# EAGLE schematic vehicle_control_module (EAGLE 9.5.2), part 2 of 2
## Sheet 16 of 16
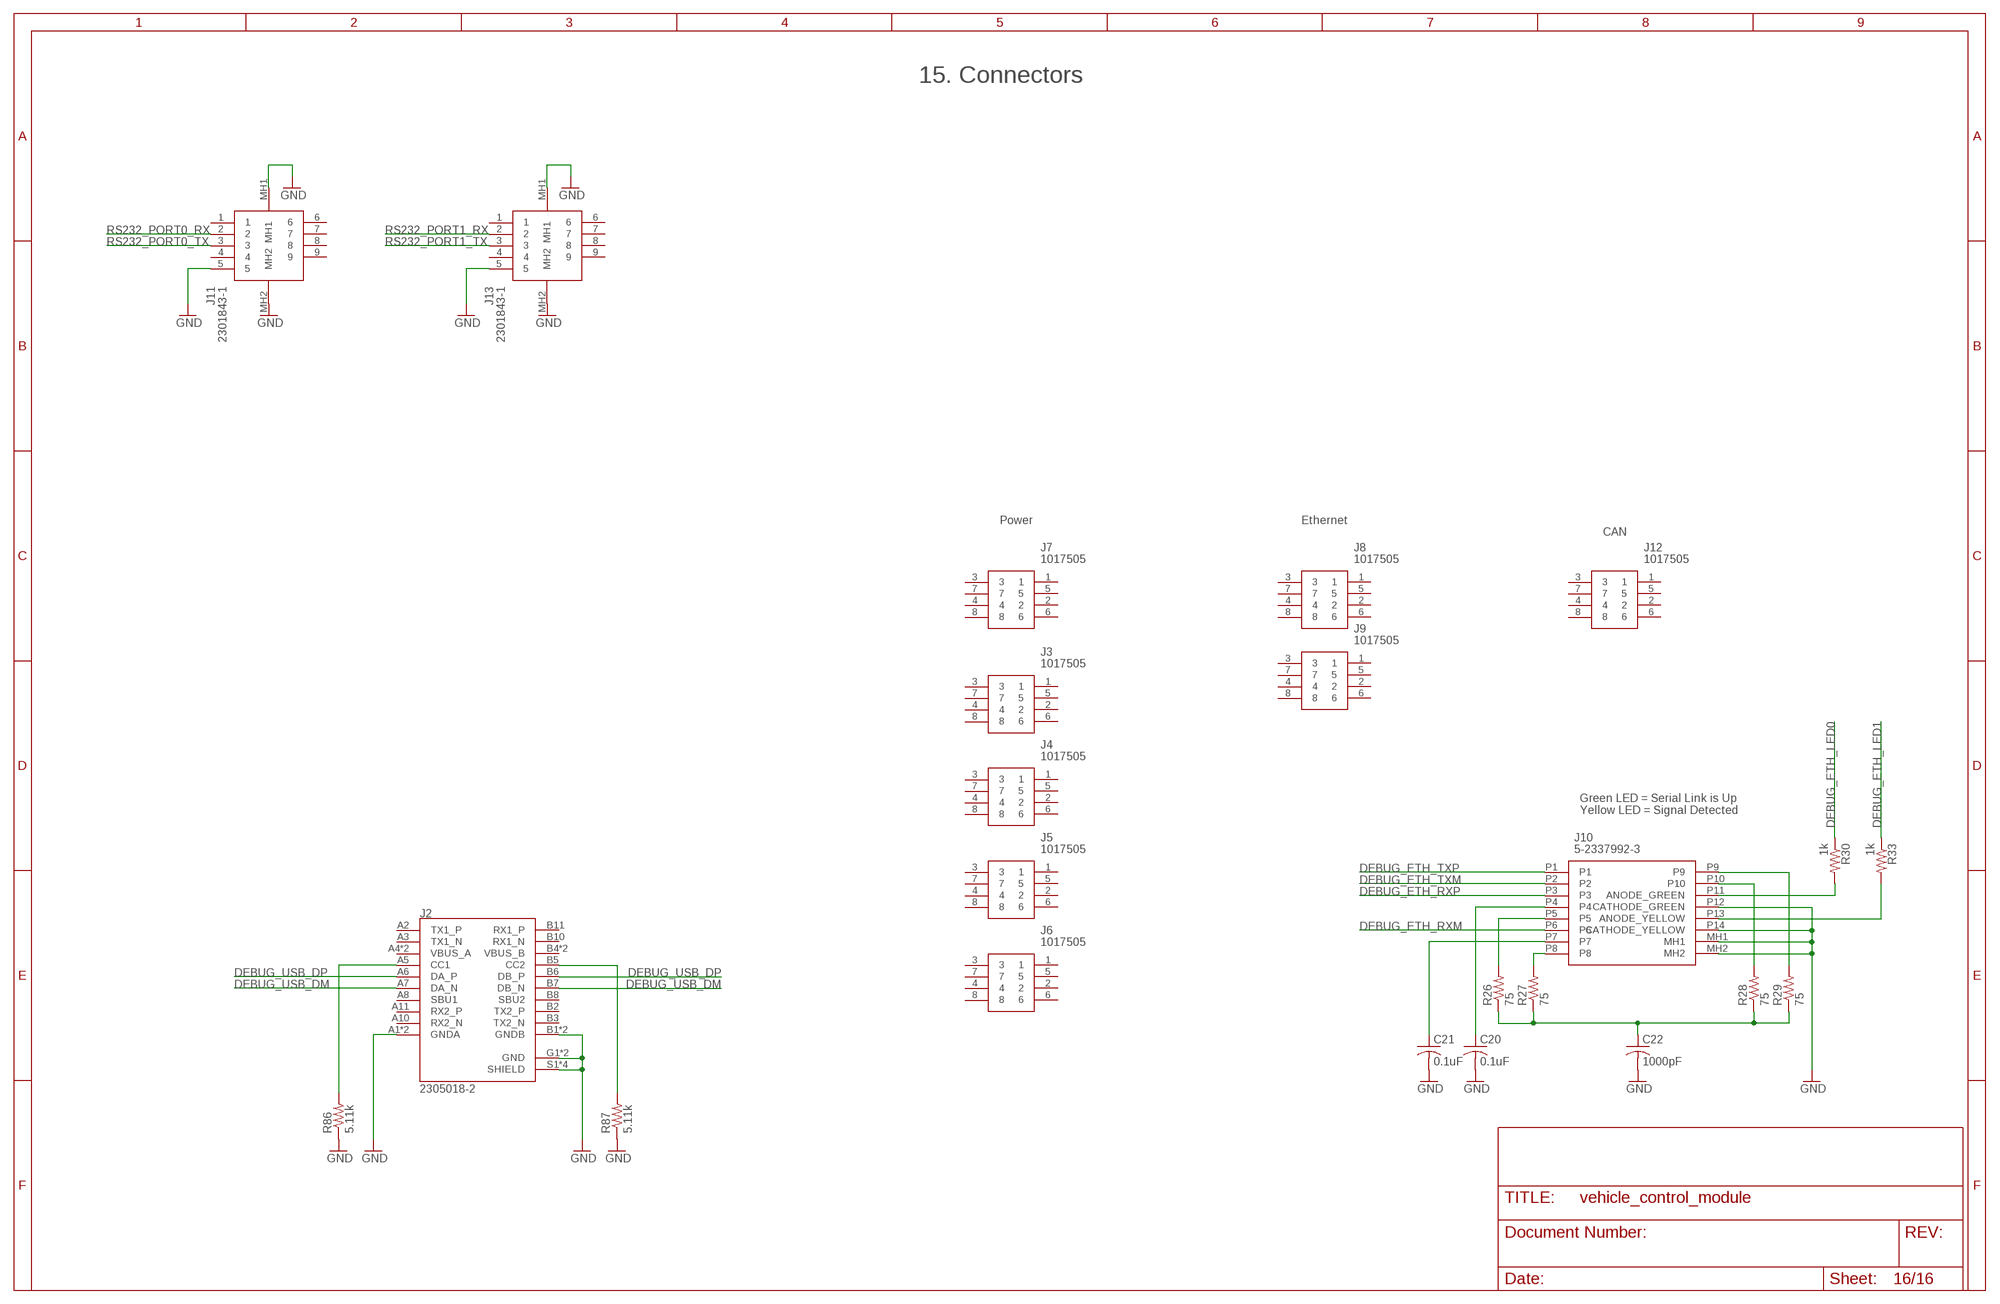
[diagram p15: schematic, sheet 16]

### Parts
C20  0.1uF  C-USC0603  [C0603]
C21  0.1uF  C-USC0603  [C0603]
C22  1000pF  C-USC0603  [C0603]
J2  2305018-2  [TE_2305018-2]
J3  1017505  [1017505]
J4  1017505  [1017505]
J5  1017505  [1017505]
J6  1017505  [1017505]
J7  1017505  [1017505]
J8  1017505  [1017505]
J9  1017505  [1017505]
J10  5-2337992-3  [523379923]
J11  2301843-1  [23018431]
J12  1017505  [1017505]
J13  2301843-1  [23018431]
R26  75  R-US_R0603  [R0603]
R27  75  R-US_R0603  [R0603]
R28  75  R-US_R0603  [R0603]
R29  75  R-US_R0603  [R0603]
R30  1k  R-US_R0603  [R0603]
R33  1k  R-US_R0603  [R0603]
R86  5.11k  R-US_R0603  [R0603]
R87  5.11k  R-US_R0603  [R0603]

### Nets
DEBUG_ETH_LED0: R30.1 ; also sheet 10
DEBUG_ETH_LED1: R33.1 ; also sheet 10
DEBUG_ETH_RXM: J10.P6 ; also sheet 10
DEBUG_ETH_RXP: J10.P3 ; also sheet 10
DEBUG_ETH_TXM: J10.P2 ; also sheet 10
DEBUG_ETH_TXP: J10.P1 ; also sheet 10
DEBUG_USB_DM: J2.A7(DA_N) J2.B7(DB_N) ; also sheet 4
DEBUG_USB_DP: J2.A6(DA_P) J2.B6(DB_P) ; also sheet 4
GND: C20.2 C21.2 C22.2 J2.A1(GNDA) J2.A12(GNDA) J2.B1(GNDB) J2.B12(GNDB) J2.G1(GND) J2.G2(GND) J2.S1(SHIELD) J2.S2(SHIELD) J2.S3(SHIELD) J2.S4(SHIELD) J10.MH1 J10.MH2 J10.P12(CATHODE_GREEN) J10.P14(CATHODE_YELLOW) J11.5 J11.MH1 J11.MH2 J13.5 J13.MH1 J13.MH2 R86.1 R87.1 ; also sheet 2,3,4,5,6,7,8,9,10,11,12,13,14,15
N$24: J10.P13(ANODE_YELLOW) R33.2
N$25: C20.1 J10.P4
N$26: J10.P5 R26.2
N$27: C21.1 J10.P7
N$28: J10.P8 R27.2
N$38: J10.P11(ANODE_GREEN) R30.2
N$39: J10.P10 R28.2
N$40: J10.P9 R29.2
N$41: C22.1 R26.1 R27.1 R28.1 R29.1
N$67: J2.A5(CC1) R86.2
N$68: J2.B5(CC2) R87.2
RS232_PORT0_RX: J11.2 ; also sheet 4
RS232_PORT0_TX: J11.3 ; also sheet 4
RS232_PORT1_RX: J13.2 ; also sheet 4
RS232_PORT1_TX: J13.3 ; also sheet 4
Unconnected: J2.A2(TX1_P) J2.A3(TX1_N) J2.A4(VBUS_A) J2.A8(SBU1) J2.A9(VBUS_A) J2.A10(RX2_N) J2.A11(RX2_P) J2.B2(TX2_P) J2.B3(TX2_N) J2.B4(VBUS_B) J2.B8(SBU2) J2.B9(VBUS_B) J2.B10(RX1_N) J2.B11(RX1_P) J3.1 J3.2 J3.3 J3.4 J3.5 J3.6 J3.7 J3.8 J4.1 J4.2 J4.3 J4.4 J4.5 J4.6 J4.7 J4.8 J5.1 J5.2 J5.3 J5.4 J5.5 J5.6 J5.7 J5.8 J6.1 J6.2 J6.3 J6.4 J6.5 J6.6 J6.7 J6.8 J7.1 J7.2 J7.3 J7.4 J7.5 J7.6 J7.7 J7.8 J8.1 J8.2 J8.3 J8.4 J8.5 J8.6 J8.7 J8.8 J9.1 J9.2 J9.3 J9.4 J9.5 J9.6 J9.7 J9.8 J11.1 J11.4 J11.6 J11.7 J11.8 J11.9 J12.1 J12.2 J12.3 J12.4 J12.5 J12.6 J12.7 J12.8 J13.1 J13.4 J13.6 J13.7 J13.8 J13.9

### Notes on the sheet
- 15. Connectors
- Power | Ethernet
- CAN
- Green LED = Serial Link is Up
  Yellow LED = Signal Detected

## Library data of the parts
C1-C29 C32-C85 C87-C96 C98-C172 = rcl:C-US: CAPACITOR, American symbol; SPICEPREFIX: C
C86 C97 = samacsys:UCZ1K151MNQ1MS: Aluminum Electrolytic Capacitors - SMD 80V 150UF 20% Source: Datasheet <http://www.nichicon.co.jp/english/products/pdfs/e-ucz.pdf>; DESCRIPTION: Aluminum Electrolytic Capacitors - SMD 80V 150UF 20%; HEIGHT: 14.5mm; MANUFACTURER_NAME: Nichicon; MANUFACTURER_PART_NUMBER: UCZ1K151MNQ1MS; MOUSER_PART_NUMBER: 647-UCZ1K151MNQ1MS; MOUSER_PRICE-STOCK: https://www.mouser.com/Search/Refine.aspx?Keyword=647-UCZ1K151MNQ1MS
D1-D3 = samacsys:PESD2ETH-AXR: ESD Suppressors / TVS Diodes PESD2ETH-AX/SOT4/REEL 7" Q3/T4 Source: Datasheet <https://assets.nexperia.com/documents/data-sheet/PESD2ETH-AX.pdf>; DESCRIPTION: ESD Suppressors / TVS Diodes PESD2ETH-AX/SOT4/REEL 7" Q3/T4; HEIGHT: 1mm; MANUFACTURER_NAME: Nexperia; MANUFACTURER_PART_NUMBER: PESD2ETH-AXR; MOUSER_PART_NUMBER: 771-PESD2ETH-AXR; MOUSER_PRICE-STOCK: https://www.mouser.com/Search/Refine.aspx?Keyword=771-PESD2ETH-AXR
D4-D6 D9 = samacsys:PMEG3030EP,115: Nexperia PMEG3030EP,115 SMT Schottky Diode, 30V 3A, 2-Pin SOD128 Source: Datasheet <https://assets.nexperia.com/documents/data-sheet/PMEG3030EP.pdf>; DESCRIPTION: Nexperia PMEG3030EP,115 SMT Schottky Diode, 30V 3A, 2-Pin SOD128; HEIGHT: 1.1mm; MANUFACTURER_NAME: Nexperia; MANUFACTURER_PART_NUMBER: PMEG3030EP,115; MOUSER_PART_NUMBER: 771-PMEG3030EP115; MOUSER_PRICE-STOCK: https://www.mouser.com/Search/Refine.aspx?Keyword=771-PMEG3030EP115; RS_PART_NUMBER: 7805391P; RS_PRICE-STOCK: http://uk.rs-online.com/web/p/products/7805391P
D7 D8 = samacsys:SMAJ24CA-Q: Bourns SMAJ24CA-Q, Bi-Directional TVS Diode, 400W, 2-Pin DO-214AC Source: Datasheet <https://www.bourns.com/docs/Product-Datasheets/SMAJ-Q.pdf>; DESCRIPTION: Bourns SMAJ24CA-Q, Bi-Directional TVS Diode, 400W, 2-Pin DO-214AC; HEIGHT: 2.29mm; MANUFACTURER_NAME: Bourns; MANUFACTURER_PART_NUMBER: SMAJ24CA-Q; MOUSER_PART_NUMBER: 652-SMAJ24CA-Q; MOUSER_PRICE-STOCK: https://www.mouser.com/Search/Refine.aspx?Keyword=652-SMAJ24CA-Q; RS_PART_NUMBER: 1723235P; RS_PRICE-STOCK: http://uk.rs-online.com/web/p/products/1723235P
D10-D35 = samacsys:BAT54SWFILMY: STMICROELECTRONICS - BAT54SWFILMY - SCHOTTKY DIODE, DUAL, AUTO, 0.3A, 40V Source: Datasheet <https://www.st.com/resource/en/datasheet/cd00001322.pdf>; DESCRIPTION: STMICROELECTRONICS - BAT54SWFILMY - SCHOTTKY DIODE, DUAL, AUTO, 0.3A, 40V; HEIGHT: 1.1mm; MANUFACTURER_NAME: STMicroelectronics; MANUFACTURER_PART_NUMBER: BAT54SWFILMY; MOUSER_PART_NUMBER: 511-BAT54SWFILMY; MOUSER_PRICE-STOCK: https://www.mouser.com/Search/Refine.aspx?Keyword=511-BAT54SWFILMY
FL1 FL5 FL9 = samacsys:ACT45L-201-2P-TL000: Common mode choke SMD 200uH 100mA 50V TDK ACT Series Shielded SMD Common Mode Line Filter 200 uH -30 %, 50 % 100mA Idc Source: Datasheet <http://docs-emea.rs-online.com/webdocs/14e9/0900766b814e92b2.pdf>; DESCRIPTION: Common mode choke SMD 200uH 100mA 50V TDK ACT Series Shielded SMD Common Mode Line Filter 200 uH -30 %, 50 % 100mA Idc; HEIGHT: mm; MANUFACTURER_NAME: TDK; MANUFACTURER_PART_NUMBER: ACT45L-201-2P-TL000; MOUSER_PART_NUMBER: 810-ACT45L2012PTL000; MOUSER_PRICE-STOCK: https://www.mouser.com/Search/Refine.aspx?Keyword=810-ACT45L2012PTL000; RS_PART_NUMBER: 8319282P; RS_PRICE-STOCK: http://uk.rs-online.com/web/p/products/8319282P
FL2-FL4 FL6-FL8 FL10-FL12 = samacsys:BLM18PG330SN1D: BLM18_N1D Series EMI Suppression Filter 33+/-25% at 100MHz 3A @85 Source: Datasheet <https://www.murata.com/en-us/products/productdetail?partno=BLM18PG330SN1#>; DESCRIPTION: BLM18_N1D Series EMI Suppression Filter 33+/-25% at 100MHz 3A @85; HEIGHT: 0.95mm; MANUFACTURER_NAME: Murata Electronics; MANUFACTURER_PART_NUMBER: BLM18PG330SN1D; MOUSER_PART_NUMBER: 81-BLM18PG330SN1D; MOUSER_PRICE-STOCK: https://www.mouser.com/Search/Refine.aspx?Keyword=81-BLM18PG330SN1D; RS_PART_NUMBER: 7241416P; RS_PRICE-STOCK: http://uk.rs-online.com/web/p/products/7241416P
IC1 = samacsys:SJA1105TELY: Ethernet ICs SJA1105TEL/LFBGA159///REEL 13 Q1/T1 *STANDARD MAR Source: Datasheet <https://www.nxp.com/docs/en/data-sheet/SJA1105.pdf>; DESCRIPTION: Ethernet ICs SJA1105TEL/LFBGA159///REEL 13 Q1/T1 *STANDARD MAR; HEIGHT: 1.5mm; MANUFACTURER_NAME: Nexperia; MANUFACTURER_PART_NUMBER: SJA1105TELY; MOUSER_PART_NUMBER: 771-SJA1105TELY; MOUSER_PRICE-STOCK: https://www.mouser.com/Search/Refine.aspx?Keyword=771-SJA1105TELY
IC2 = samacsys:ATSAMV71Q21B-AABT: ARM Microcontrollers - MCU 2MB FLASH 384KB SRAM LQFP144 T/R Source: Datasheet <https://www.mouser.com/datasheet/2/268/SAM-E70S70V70V71-Family_DataSheet-DS60001527B-1374834.pdf>; DESCRIPTION: ARM Microcontrollers - MCU 2MB FLASH 384KB SRAM LQFP144 T/R; HEIGHT: 1.6mm; MANUFACTURER_NAME: Microchip; MANUFACTURER_PART_NUMBER: ATSAMV71Q21B-AABT; MOUSER_PART_NUMBER: 579-ATSAMV71Q21BAABT; MOUSER_PRICE-STOCK: https://www.mouser.com/Search/Refine.aspx?Keyword=579-ATSAMV71Q21BAABT
IC3 IC10 IC12 = samacsys:TJA1100HNZ: NXP - TJA1100HNZ - ETHERNET PHY, AEC-Q100, 100MBPS, HVQFN36 Source: Datasheet <https://www.nxp.com/docs/en/data-sheet/TJA1100.pdf>; DESCRIPTION: NXP - TJA1100HNZ - ETHERNET PHY, AEC-Q100, 100MBPS, HVQFN36; HEIGHT: 1mm; MANUFACTURER_NAME: Nexperia; MANUFACTURER_PART_NUMBER: TJA1100HNZ; MOUSER_PART_NUMBER: 771-TJA1100HNZ; MOUSER_PRICE-STOCK: https://www.mouser.com/Search/Refine.aspx?Keyword=771-TJA1100HNZ
IC4 = samacsys:FT2232HL: Dual High Speed USB UART/FIFO IC, LQFP64 FTDI Chip FT2232HL Dual UART Interface RS232, RS422, RS485 480Mbit/s, 64-Pin, LQFP Source: Datasheet <http://docs-emea.rs-online.com/webdocs/1384/0900766b81384546.pdf>; DESCRIPTION: Dual High Speed USB UART/FIFO IC, LQFP64 FTDI Chip FT2232HL Dual UART Interface RS232, RS422, RS485 480Mbit/s, 64-Pin, LQFP; HEIGHT: 1.6mm; MANUFACTURER_NAME: FTDI Chip; MANUFACTURER_PART_NUMBER: FT2232HL; RS_PART_NUMBER: 6877720P; RS_PRICE-STOCK: http://uk.rs-online.com/web/p/products/6877720P
IC5 = samacsys:TRS3232EQPWRQ1: Automotive Catalog 3-V to 5.5-V Multichannel RS-232 Line Driver/Receiver With +/-15-kV ESD Protectio Source: Datasheet <http://www.ti.com/lit/gpn/trs3232e-q1>; DESCRIPTION: Automotive Catalog 3-V to 5.5-V Multichannel RS-232 Line Driver/Receiver With +/-15-kV ESD Protectio; HEIGHT: 1.2mm; MANUFACTURER_NAME: Texas Instruments; MANUFACTURER_PART_NUMBER: TRS3232EQPWRQ1; MOUSER_PART_NUMBER: 595-TRS3232EQPWRQ1; MOUSER_PRICE-STOCK: https://www.mouser.com/Search/Refine.aspx?Keyword=595-TRS3232EQPWRQ1
IC6 = samacsys:SST26VF032BT-104I_SM: Microchip Technology SST26VF032BT-104I/SM 32Mbit Flash Memory Chip, 8-Pin SOIJ Source: Datasheet <http://www.microchip.com/mymicrochip/filehandler.aspx?ddocname=en566514>; ALLIED_NUMBER: 70571081; ALLIED_PRICE-STOCK: https://www.alliedelec.com/microchiptechnologyinc-sst26vf032bt-104i-sm/70571081/; DESCRIPTION: Microchip Technology SST26VF032BT-104I/SM 32Mbit Flash Memory Chip, 8-Pin SOIJ; HEIGHT: 2.03mm; MANUFACTURER_NAME: Microchip; MANUFACTURER_PART_NUMBER: SST26VF032BT-104I/SM; MOUSER_PART_NUMBER: 579-T26VF032BT104ISM; MOUSER_PRICE-STOCK: https://www.mouser.com/Search/Refine.aspx?Keyword=579-T26VF032BT104ISM; RS_PART_NUMBER: 1779838P; RS_PRICE-STOCK: http://uk.rs-online.com/web/p/products/1779838P
IC7 = samacsys:DS3231SN#: Real Time Clock Serial Maxim DS3231SN# Real Time Clock, Battery Backup, Calendar, Clock, I2C, 5.5 V, 16-Pin SOIC Source: Datasheet <https://datasheets.maximintegrated.com/en/ds/DS3231.pdf>; DESCRIPTION: Real Time Clock Serial Maxim DS3231SN# Real Time Clock, Battery Backup, Calendar, Clock, I2C, 5.5 V, 16-Pin SOIC; HEIGHT: 2.65mm; MANUFACTURER_NAME: Maxim Integrated; MANUFACTURER_PART_NUMBER: DS3231SN#; MOUSER_PART_NUMBER: 700-DS3231SN#; MOUSER_PRICE-STOCK: https://www.mouser.com/Search/Refine.aspx?Keyword=700-DS3231SN%23; RS_PART_NUMBER: 1897251; RS_PRICE-STOCK: http://uk.rs-online.com/web/p/products/1897251
IC8 = samacsys:74HC7541D-Q100J: 74HC(T)7541-Q100 - Octal Schmitt trigger buffer/line driver; 3-state@en-us Source: Datasheet <https://assets.nexperia.com/documents/data-sheet/74HC_HCT7541_Q100.pdf>; DESCRIPTION: 74HC(T)7541-Q100 - Octal Schmitt trigger buffer/line driver; 3-state@en-us; HEIGHT: 2.65mm; MANUFACTURER_NAME: Nexperia; MANUFACTURER_PART_NUMBER: 74HC7541D-Q100J; MOUSER_PART_NUMBER: 771-74HC7541D-Q100J; MOUSER_PRICE-STOCK: https://www.mouser.com/Search/Refine.aspx?Keyword=771-74HC7541D-Q100J
IC9 = samacsys:TPS62242DRVR: 1.2V / 300mA Step-Down Converter in 2x2mm SON/TSOT23 Package Source: Datasheet <http://www.ti.com/lit/gpn/TPS62242>; DESCRIPTION: 1.2V / 300mA Step-Down Converter in 2x2mm SON/TSOT23 Package; HEIGHT: 0.8mm; MANUFACTURER_NAME: Texas Instruments; MANUFACTURER_PART_NUMBER: TPS62242DRVR; MOUSER_PART_NUMBER: 595-TPS62242DRVR; MOUSER_PRICE-STOCK: https://www.mouser.com/Search/Refine.aspx?Keyword=595-TPS62242DRVR
IC11 = samacsys:KSZ8061MNXI-TR: Ethernet ICs 10/100 Base-TX/FX Quiet-Wire x-ceiver Source: Datasheet <https://componentsearchengine.com/Datasheets/1/KSZ8061MNXI-TR.pdf>; DESCRIPTION: Ethernet ICs 10/100 Base-TX/FX Quiet-Wire x-ceiver; HEIGHT: 0.85mm; MANUFACTURER_NAME: Microchip; MANUFACTURER_PART_NUMBER: KSZ8061MNXI-TR; MOUSER_PART_NUMBER: 579-KSZ8061MNXI-TR; MOUSER_PRICE-STOCK: https://www.mouser.com/Search/Refine.aspx?Keyword=579-KSZ8061MNXI-TR
IC13 IC18 = samacsys:TLE9250XSJXUMA1: CAN Interface IC TRANSCEIVER Source: Datasheet <https://www.infineon.com/dgdl/Infineon-TLE9250X-DS-v01_00-EN.pdf?fileId=5546d4625debb399015e14b8cc665980>; DESCRIPTION: CAN Interface IC TRANSCEIVER; HEIGHT: 1.73mm; MANUFACTURER_NAME: Infineon; MANUFACTURER_PART_NUMBER: TLE9250XSJXUMA1; MOUSER_PART_NUMBER: 726-TLE9250XSJXUMA1; MOUSER_PRICE-STOCK: https://www.mouser.com/Search/Refine.aspx?Keyword=726-TLE9250XSJXUMA1
IC17 = samacsys:LP5907QMFX-3.3Q1: Automotive 250-mA ultra-low-noise low-IQ low-dropout (LDO) linear regulator Source: Datasheet <http://www.ti.com/lit/gpn/lp5907-q1>; DESCRIPTION: Automotive 250-mA ultra-low-noise low-IQ low-dropout (LDO) linear regulator; HEIGHT: 1.45mm; MANUFACTURER_NAME: Texas Instruments; MANUFACTURER_PART_NUMBER: LP5907QMFX-3.3Q1; MOUSER_PART_NUMBER: 595-LP5907QMFX-3.3Q1; MOUSER_PRICE-STOCK: https://www.mouser.com/Search/Refine.aspx?Keyword=595-LP5907QMFX-3.3Q1
J2 = 2305018-2:2305018-2: TYPE C Right Angle Sealable SMT IPX8 3.1 GEN 2 Wire to Board USB; MANUFACTURER: TE Connectivity; PARTREV: 6.0; STANDRAD: Manufacturer Recommendation
J3-J9 J12 = samacsys:1017505: Phoenix Contact TDPT Series 5.08mm Pitch, PCB Terminal Block, PCB Mount, 4 Way Source: Datasheet <https://www.phoenixcontact.com/online/portal/gb/?uri=pxc-oc-itemdetail:pid=1017505&library=gben&pcck=P-11-01-05&tab=1&selectedCategory=ALL>; ALLIED_NUMBER: 71241694; ALLIED_PRICE-STOCK: https://www.alliedelec.com/phoenixcontact-1017505/71241694/; DESCRIPTION: Phoenix Contact TDPT Series 5.08mm Pitch, PCB Terminal Block, PCB Mount, 4 Way; HEIGHT: 19.2mm; MANUFACTURER_NAME: Phoenix Contact; MANUFACTURER_PART_NUMBER: 1017505; MOUSER_PART_NUMBER: 651-1017505; MOUSER_PRICE-STOCK: https://www.mouser.com/Search/Refine.aspx?Keyword=651-1017505; RS_PART_NUMBER: 1753922; RS_PRICE-STOCK: http://uk.rs-online.com/web/p/products/1753922
J10 = samacsys:5-2337992-3: RJ45 JACK MAG. POE 10/100 LED 1X1 INV.-5-2337992-3 Industrial RJ45 IP20 , Industrial RJ45 Mag Jack Source: Datasheet <https://www.te.com/commerce/DocumentDelivery/DDEController?Action=showdoc&DocId=Customer Drawing5-2337992-3ApdfEnglishENG_CD_5-2337992-3_A.pdf5-2337992-3>; ALLIED_NUMBER: 71642175; ALLIED_PRICE-STOCK: https://www.alliedelec.com/teconnectivity-5-2337992-3/71642175/; DESCRIPTION: RJ45 JACK MAG. POE 10/100 LED 1X1 INV.-5-2337992-3 Industrial RJ45 IP20 , Industrial RJ45 Mag Jack; HEIGHT: 13.8mm; MANUFACTURER_NAME: TE Connectivity; MANUFACTURER_PART_NUMBER: 5-2337992-3; MOUSER_PART_NUMBER: 571-5-2337992-3; MOUSER_PRICE-STOCK: https://www.mouser.com/Search/Refine.aspx?Keyword=571-5-2337992-3
J11 J13 = samacsys:2301843-1: TE CONNECTIVITY - 2301843-1 - D-SUB CONN, PLUG, 9POS, THROUGH HOLE Source: Datasheet <https://componentsearchengine.com/Datasheets/2/2301843-1.pdf>; DESCRIPTION: TE CONNECTIVITY - 2301843-1 - D-SUB CONN, PLUG, 9POS, THROUGH HOLE; HEIGHT: 13.955mm; MANUFACTURER_NAME: TE Connectivity; MANUFACTURER_PART_NUMBER: 2301843-1; MOUSER_PART_NUMBER: 571-2301843-1; MOUSER_PRICE-STOCK: https://www.mouser.com/Search/Refine.aspx?Keyword=571-2301843-1
J15 = samacsys:693022010811: WURTH ELEKTRONIK - 693022010811 - CONN, MICRO SIM, HINGE, 8POS Source: Datasheet <http://katalog.we-online.de/em/datasheet/693022010811.pdf>; DESCRIPTION: WURTH ELEKTRONIK - 693022010811 - CONN, MICRO SIM, HINGE, 8POS; HEIGHT: mm; MANUFACTURER_NAME: Wurth Elektronik; MANUFACTURER_PART_NUMBER: 693022010811; MOUSER_PART_NUMBER: 710-693022010811; MOUSER_PRICE-STOCK: https://www.mouser.com/Search/Refine.aspx?Keyword=710-693022010811; RS_PART_NUMBER: 1621816; RS_PRICE-STOCK: http://uk.rs-online.com/web/p/products/1621816
J27 = samacsys:2041119-2: PCI Express / PCI Connectors mSATA/mini PCI-E 4H Type I 10u Source: Datasheet <https://www.te.com/commerce/DocumentDelivery/DDEController?Action=showdoc&DocId=Customer Drawing2041119DpdfEnglishENG_CD_2041119_D.pdf2041119-2>; DESCRIPTION: PCI Express / PCI Connectors mSATA/mini PCI-E 4H Type I 10u; HEIGHT: 4mm; MANUFACTURER_NAME: TE Connectivity; MANUFACTURER_PART_NUMBER: 2041119-2; MOUSER_PART_NUMBER: 571-2041119-2; MOUSER_PRICE-STOCK: https://www.mouser.com/Search/Refine.aspx?Keyword=571-2041119-2
L1-L6 = samacsys:0603CS-R12XGLU: COILCRAFT - 0603CS-R12XGLU - High Frequency Inductor, 120 nH, 0603CS Series, 300 mA, 0603 [1608 Metric], Wirewound, 0.65 ohm Source: Datasheet <https://www.coilcraft.com/pdfs/0603cs.pdf>; DESCRIPTION: COILCRAFT - 0603CS-R12XGLU - High Frequency Inductor, 120 nH, 0603CS Series, 300 mA, 0603 [1608 Metric], Wirewound, 0.65 ohm; HEIGHT: 1mm; MANUFACTURER_NAME: COILCRAFT; MANUFACTURER_PART_NUMBER: 0603CS-R12XGLU; MOUSER_PART_NUMBER: 994-0603CS-R12XGLU; MOUSER_PRICE-STOCK: https://www.mouser.com/Search/Refine.aspx?Keyword=994-0603CS-R12XGLU
L7 = samacsys:XAL4020-102MEC: Fixed Inductors 1uH 20% 9.6A 14.60mOhms AEC-Q200 Source: Datasheet <https://www.coilcraft.com/pdfs/xal4000.pdf>; DESCRIPTION: Fixed Inductors 1uH 20% 9.6A 14.60mOhms AEC-Q200; HEIGHT: mm; MANUFACTURER_NAME: COILCRAFT; MANUFACTURER_PART_NUMBER: XAL4020-102MEC; MOUSER_PART_NUMBER: 994-XAL4020-102MEC; MOUSER_PRICE-STOCK: https://www.mouser.com/Search/Refine.aspx?Keyword=994-XAL4020-102MEC
L8 = samacsys:XAL4040-103MEC: Fixed Inductors XAL4040 High Current 10 uH 20 % 3.1 A Source: Datasheet <http://www.mouser.com/ds/2/597/xal4000-270751.pdf>; DESCRIPTION: Fixed Inductors XAL4040 High Current 10 uH 20 % 3.1 A; HEIGHT: mm; MANUFACTURER_NAME: COILCRAFT; MANUFACTURER_PART_NUMBER: XAL4040-103MEC; MOUSER_PART_NUMBER: 994-XAL4040-103MEC; MOUSER_PRICE-STOCK: https://www.mouser.com/Search/Refine.aspx?Keyword=994-XAL4040-103MEC
L9 = samacsys:DO3316P-103MLB: Fixed Inductors DO3316P SMT Pwr Ind 10 uH 20 % 3.9 A Source: Datasheet <https://componentsearchengine.com/Datasheets/1/DO3316P-103MLB.pdf>; DESCRIPTION: Fixed Inductors DO3316P SMT Pwr Ind 10 uH 20 % 3.9 A; HEIGHT: 5.21mm; MANUFACTURER_NAME: COILCRAFT; MANUFACTURER_PART_NUMBER: DO3316P-103MLB; MOUSER_PART_NUMBER: 994-DO3316P-103MLB; MOUSER_PRICE-STOCK: https://www.mouser.com/Search/Refine.aspx?Keyword=994-DO3316P-103MLB
L10 = samacsys:LPS3015-222MRB: COILCRAFT - LPS3015-222MRB - INDUCTOR, SHLD, 2.2UH, 20%, 1.1A, SMD Source: Datasheet <https://www.coilcraft.com/misc/lps3015d.html>; DESCRIPTION: COILCRAFT - LPS3015-222MRB - INDUCTOR, SHLD, 2.2UH, 20%, 1.1A, SMD; HEIGHT: mm; MANUFACTURER_NAME: COILCRAFT; MANUFACTURER_PART_NUMBER: LPS3015-222MRB; MOUSER_PART_NUMBER: 994-LPS3015-222MRB; MOUSER_PRICE-STOCK: https://www.mouser.com/Search/Refine.aspx?Keyword=994-LPS3015-222MRB
LED1-LED16 = led:LED: LED OSRAM: - CHIPLED LG R971, LG N971, LY N971, LG Q971, LY Q971, LO R971, LY R971 LH N974, LH R974 LS Q976, LO Q976, LY Q976 LO Q996 - Hyper CHIPLED LW Q18S LB Q993, LB Q99A, LB R99A - SideLED LS A670, LO A670, LY A670, LG A670, LP A670 LB A673, LV A673, LT A673, LW A673 LH A674 LY A675 LS A676, LA A676, LO A676, LY A676, LW A676 LS A679, LY A679, LG A679 - Hyper Micro SIDELED® LS Y876, LA Y876, LO Y876, LY Y876 LT Y87S - SmartLED LW L88C, LW L88S LB L89C, LB L89S, LG L890 LS L89K, LO L89K, LY L89K LS L896, LA L896, LO L896, LY L896 - TOPLED LS T670, LO T670, LY T670, LG T670, LP T670 LSG T670, LSP T670, LSY T670, LOP T670, LYG T670 LG T671, LOG T671, LSG T671 LB T673, LV T673, LT T673, LW T673 LH T674 LS T676, LA T676, LO T676, LY T676, LB T676, LH T676, LSB T676, LW T676 LB T67C, LV T67C, LT T67C, LS T67K, LO T67K, LY T67K, LW E67C LS E67B, LA E67B, LO E67B, LY E67B, LB E67C, LV E67C, LT E67C LW T67C LS T679, LY T679, LG T679 LS T770, LO T770, LY T770, LG T770, LP T770 LB T773, LV T773, LT T773, LW T773 LH T774 LS E675, LA E675, LY E675, LS T675 LS T776, LA T776, LO T776, LY T776, LB T776 LHGB T686 LT T68C, LB T68C - Hyper Mini TOPLED® LB M676 - Mini TOPLED Santana® LG M470 LS M47K, LO M47K, LY M47K Source: http://www.osram.convergy.de LUXEON: - LUMILED® LXK2-PW12-R00, LXK2-PW12-S00, LXK2-PW14-U00, LXK2-PW14-V00 LXK2-PM12-R00, LXK2-PM12-S00, LXK2-PM14-U00 LXK2-PE12-Q00, LXK2-PE12-R00, LXK2-PE12-S00, LXK2-PE14-T00, LXK2-PE14-U00 LXK2-PB12-K00, LXK2-PB12-L00, LXK2-PB12-M00, LXK2-PB14-N00, LXK2-PB14-P00, LXK2-PB14-Q00 LXK2-PR12-L00, LXK2-PR12-M00, LXK2-PR14-Q00, LXK2-PR14-R00 LXK2-PD12-Q00, LXK2-PD12-R00, LXK2-PD12-S00 LXK2-PH12-R00, LXK2-PH12-S00 LXK2-PL12-P00, LXK2-PL12-Q00, LXK2-PL12-R00 Source: www.luxeon.com KINGBRIGHT: KA-3528ASYC Source: www.kingbright.com
R1-R199 = rcl:R-US_: RESISTOR, American symbol; SPICEPREFIX: R
TC1 = TagConnect:TC2050-IDC: Tag-Connect In Circuit Programming & Debug Cable 10 Pin http://www.tag-connect.com
U1 = samacsys:122-2920-GR: Coin Cell Battery Holders 20MM THRUHOLE WH Source: Datasheet <https://www.mouser.com/datasheet/2/209/EPD-200695-1171359.pdf>; DESCRIPTION: Coin Cell Battery Holders 20MM THRUHOLE WH; HEIGHT: 5.5mm; MANUFACTURER_NAME: Eagle Plastic Devices; MANUFACTURER_PART_NUMBER: 122-2920-GR; MOUSER_PART_NUMBER: 122-2920-GR; MOUSER_PRICE-STOCK: https://www.mouser.com/Search/Refine.aspx?Keyword=122-2920-GR
U2 = LM63625:LM63625DQPWPRQ1; MANUFACTURER: Texas Instruments; PARTNUMBER: LM63625DQPWPTQ1; REFDES: RefDes; TYPE: TYPE; VALUE: Value
U3 = TPS62007:TPS62007-Q1_DGS_10; DATASHEET_URL: http://www.ti.com/lit/gpn/TPS62007-Q1; DESCRIPTION: Automotive Catalog High-Efficiency Step-Down Low Power DC-DC Converter; FAMILY_NAME: STEP-DOWN REGULATOR; GENERIC_PART_NUMBER: TPS62007-Q1; INDUSTRY_STD_PKG_TYPE: MSOP; MANUFACTURER: Texas Instruments; MANUFACTURER_PART_NUMBER: TPS62007-Q1_DGS_10; PACKAGE_DESIGNATOR: DGS; PIN_COUNT: 10; VENDOR: Texas Instruments
U?1-U?18 = BTS50015-1TAD:BTS50015-1TAD: BTS50015-1TAD TO127P1500X450-7_8N-V1 Smart High-Side Power Switch, One channel device
Y1 = samacsys:NX3225SA-25MHZ-EXS00A-CS11338: CRYSTAL 25MHZ 18PF SMD Source: Datasheet <https://media.digikey.com/pdf/Data Sheets/NDK PDFs/NX3225SA-25MHZ-EXS00A-CS11338.pdf>; DESCRIPTION: CRYSTAL 25MHZ 18PF SMD; HEIGHT: 0.6mm; MANUFACTURER_NAME: NDK; MANUFACTURER_PART_NUMBER: NX3225SA-25MHZ-EXS00A-CS11338
Y2 = samacsys:ABM8AIG-12.000MHZ-12-D2Z-T: ABRACON - ABM8AIG-12.000MHZ-12-D2Z-T - CRYSTAL, AECQ200, 12MHZ, 12PF, 3.2X2.5MM Source: Datasheet <https://www.mouser.com/datasheet/2/3/ABM8AIG-783590.pdf>; DESCRIPTION: ABRACON - ABM8AIG-12.000MHZ-12-D2Z-T - CRYSTAL, AECQ200, 12MHZ, 12PF, 3.2X2.5MM; HEIGHT: 0.8mm; MANUFACTURER_NAME: ABRACON; MANUFACTURER_PART_NUMBER: ABM8AIG-12.000MHz-12-D2Z-T; MOUSER_PART_NUMBER: 815-ABM8AIG1212D2ZT; MOUSER_PRICE-STOCK: https://www.mouser.com/Search/Refine.aspx?Keyword=815-ABM8AIG1212D2ZT
Y3 = samacsys:ABM8AIG-12.000MHZ-1Z-T: Crystals 18pF 12MHz 10ppm AEC-Q200 -40C +125C Source: Datasheet <https://abracon.com/AIGcrystals/ABM8AIG.pdf>; DESCRIPTION: Crystals 18pF 12MHz 10ppm AEC-Q200 -40C +125C; HEIGHT: 0mm; MANUFACTURER_NAME: ABRACON; MANUFACTURER_PART_NUMBER: ABM8AIG-12.000MHZ-1Z-T; MOUSER_PART_NUMBER: 815-M8AIG-12-1ZT; MOUSER_PRICE-STOCK: https://www.mouser.com/Search/Refine.aspx?Keyword=815-M8AIG-12-1ZT